# Altium project Acoustic Guitar Tuner.PrjPcb
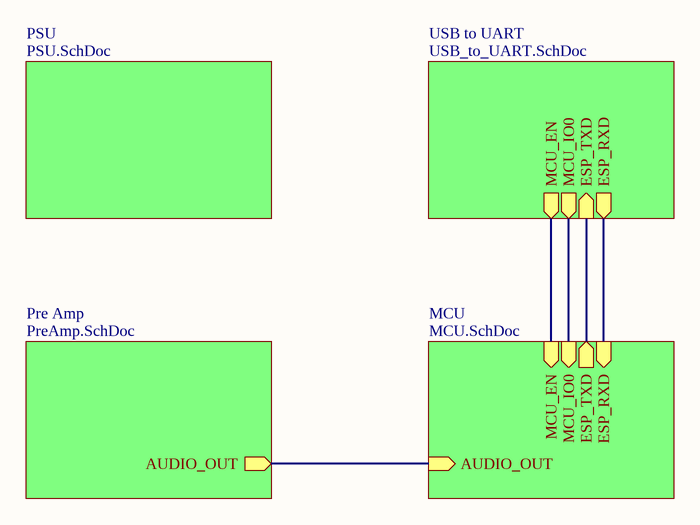
[diagram p0: MainSheet.SchDoc]
5 sheets, 67 parts. Net scope: hierarchical (ports join the sheet entries above them; power ports are global).
Board file: PCB1.PcbDoc
Sheets:
  MainSheet.SchDoc
    Pre Amp = PreAmp.SchDoc
    MCU = MCU.SchDoc
    PSU = PSU.SchDoc
    USB to UART = USB_to_UART.SchDoc

## Sheet MainSheet.SchDoc
size A; SheetNumber: 1; SheetTotal: 5

### Sub-sheets
MCU = MCU.SchDoc: ESP_TXD (out), ESP_RXD (in), MCU_EN (in), MCU_IO0 (in), AUDIO_OUT (in)
Pre Amp = PreAmp.SchDoc: AUDIO_OUT (out)
PSU = PSU.SchDoc: no entries
USB to UART = USB_to_UART.SchDoc: ESP_TXD (in), ESP_RXD (out), MCU_IO0 (out), MCU_EN (out)

### Nets
AUDIO_OUT: sheet Pre Amp/AUDIO_OUT, sheet MCU/AUDIO_OUT
NetC7_2: sheet MCU/MCU_EN, sheet USB to UART/MCU_EN
NetIC2_25: sheet MCU/MCU_IO0, sheet USB to UART/MCU_IO0
NetIC2_34: sheet MCU/ESP_RXD, sheet USB to UART/ESP_RXD
NetIC2_35: sheet MCU/ESP_TXD, sheet USB to UART/ESP_TXD

## Sheet PreAmp.SchDoc
size A; SheetNumber: 2; SheetTotal: 5
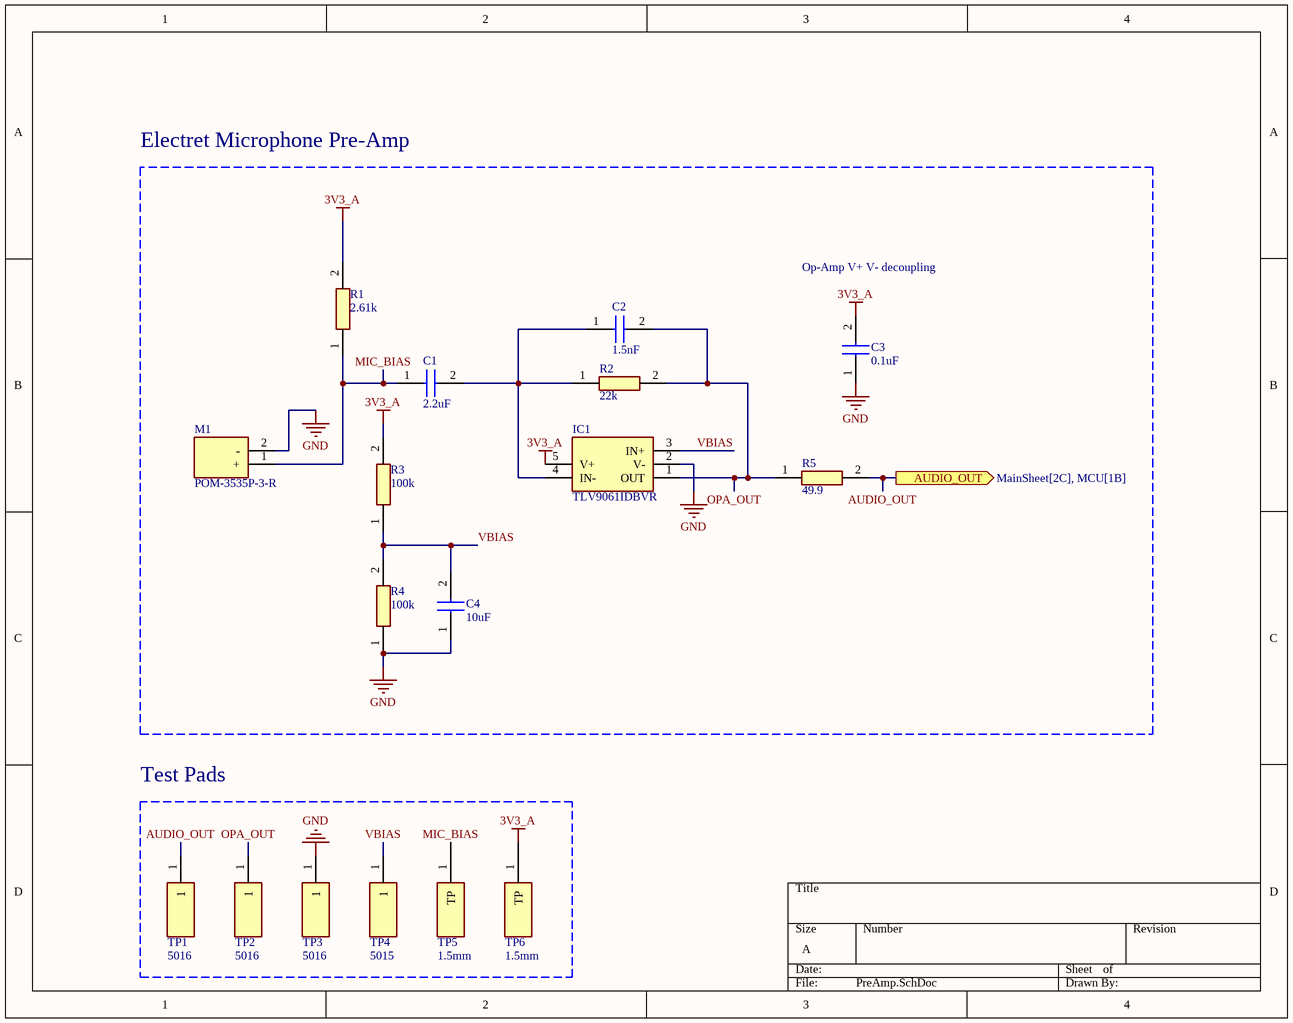
[diagram p1: PreAmp.SchDoc]

### Parts
C1  2.2uF  [C0805]
C2  1.5nF  [C0805]
C3  0.1uF  [CAPC2012X88N]
C4  10uF  [CAPC2012X140N]
IC1  TLV9061IDBVR  [SOT95P280X145-5N]
M1  POM-3535P-3-R  [POM3535P3R]
R1  2.61k  [RESC2012X60N]
R2  22k  [RESC2012X50N]
R3  100k  [RESC2012X60N]
R4  100k  [RESC2012X60N]
R5  49.9  [RESC2012X50N]
TP1  5016  [5016]
TP2  5016  [5016]
TP3  5016  [5016]
TP4  5015  [5015]
TP5  1.5mm  [TESTPAD_1P5MM]
TP6  1.5mm  [TESTPAD_1P5MM]

### Blocks framed on the sheet
Electret Microphone Pre-Amp: C1-C4 IC1 M1 R1-R5
Test Pads: TP1-TP6

### Ports
AUDIO_OUT (out, see MainSheet[2C], MCU[1B])

### Nets
3V3_A: C3.2 IC1.5(V+) R1.2 R3.2 TP6.1(TP)
GND: C3.1 C4.1 IC1.2(V-) M1.2(-) R4.1 TP3.1
AUDIO_OUT: R5.2 TP1.1 ; port AUDIO_OUT
MIC_BIAS: C1.1 M1.1(+) R1.1 TP5.1(TP)
OPA_OUT: C2.2 IC1.1(OUT) R2.2 R5.1 TP2.1
VBIAS: C4.2 IC1.3(IN+) R3.1 R4.2 TP4.1
NetC1_2: C1.2 C2.1 IC1.4(IN-) R2.1

### Notes on the sheet
- Op-Amp V+ V- decoupling

### Library data of the parts
C1 = 2.2uF Capacitor 0805: Capacitor; Manufacturer_Name: Yageo Group; Manufacturer_Part_Number: C0805C225K8PACTU; Datasheet Link: https://www.yageogroup.com/content/datasheet/asset/file/KEM_C1006_X5R_SMD; Height: 1.1mm; Mouser Part Number: 80-C0805C225K8P; Mouser Price/Stock: https://www.mouser.co.uk/ProductDetail/KEMET/C0805C225K8PACTU?qs=hIohqi1S7IpPfscGpw9Z0g%3D%3D; Arrow Part Number: C0805C225K8PACTU; Arrow Price/Stock: https://www.arrow.com/en/products/c0805c225k8pactu/kemet-corporation?region=nac
C2 = 1.5nF Capaciator 0805: Capacitor; Manufacturer_Name: Yageo Group; Manufacturer_Part_Number: C0805C152J5GACTU; Datasheet Link: https://www.yageogroup.com/content/datasheet/asset/file/KEM_C1003_C0G_SMD; Height: 1.1mm
C3 = 0.1uF Capacitor 0805: Capacitor; Manufacturer_Name: Yageo Group; Manufacturer_Part_Number: C0805C104K5RAC-TU; Datasheet Link: https://componentsearchengine.com/Datasheets/2/C0805C104K5RAC-TU.pdf; Height: 0.88mm; Arrow Part Number: C0805C104K5RAC-TU; Arrow Price/Stock: https://www.arrow.com/en/products/c0805c104k5ractu/kemet-corporation
C4 = 10uF Capacitor 0805: Capacitor; Manufacturer_Name: Yageo Group; Manufacturer_Part_Number: C0805C106K8PACTU-2.5; Datasheet Link: https://www.kemet.com/specsheet/C0805C106K8PACTU; Height: 1.4mm; Mouser Part Number: N/A; Mouser Price/Stock: https://www.mouser.com/Search/Refine.aspx?Keyword=N%2FA
IC1 = TLV9061IDBVR: Integrated Circuit; Manufacturer_Name: Texas Instruments; Datasheet Link: http://www.ti.com/lit/gpn/tlv9061; Height: 1.45mm; Manufacturer_Part_Number: TLV9061IDBVR; Mouser Part Number: 595-TLV9061IDBVR; Mouser Price/Stock: https://www.mouser.co.uk/ProductDetail/Texas-Instruments/TLV9061IDBVR?qs=w%2Fv1CP2dgqpra2GA6pq5aQ%3D%3D; Arrow Part Number: TLV9061IDBVR; Arrow Price/Stock: https://www.arrow.com/en/products/tlv9061idbvr/texas-instruments?utm_currency=USD&region=nac
M1 = Electret Microphone: Microphone; Manufacturer_Name: PUI Audio; Datasheet Link: https://componentsearchengine.com/Datasheets/1/POM-3535P-3-R.pdf; Height: 4mm; Manufacturer_Part_Number: POM-3535P-3-R; Mouser Part Number: 665-POM-3535P-3-R; Mouser Price/Stock: https://www.mouser.co.uk/ProductDetail/PUI-Audio/POM-3535P-3-R?qs=SFtkwOqhffnBMPjb%2F%2FZCSg%3D%3D
R1 = 2.61k Resistor 0805: Resistor; Manufacturer_Name: Yageo Group; Manufacturer_Part_Number: RC0805FR-072K61L; Datasheet Link: http://www.yageo.com/documents/recent/PYu-RC_Group_51_RoHS_L_10.pdf; Height: 0.6mm; Mouser Part Number: 603-RC0805FR-072K61L; Mouser Price/Stock: https://www.mouser.co.uk/ProductDetail/Yageo/RC0805FR-072K61L?qs=QrWOOBGzeCaZVRFf6Fg7Ew%3D%3D; Arrow Part Number: RC0805FR-072K61L; Arrow Price/Stock: https://www.arrow.com/en/products/rc0805fr-072k61l/yageo?region=nac
R2 = 22k Resistor 0805: Resistor; Manufacturer_Name: Vishay; Manufacturer_Part_Number: CRCW080522K0FKEA; Datasheet Link: http://www.vishay.com/docs/20035/dcrcwe3.pdf; Height: 0.5mm; Mouser Part Number: 71-CRCW0805-22K-E3; Mouser Price/Stock: https://www.mouser.co.uk/ProductDetail/Vishay-Dale/CRCW080522K0FKEA?qs=fIsz7OpyEY835T0D7WGkRw%3D%3D; Arrow Part Number: CRCW080522K0FKEA; Arrow Price/Stock: https://www.arrow.com/en/products/crcw080522k0fkea/vishay?region=europe
R3 R4 = 100k Resistor: Resistor; Manufacturer_Name: Vishay; Manufacturer_Part_Number: CRCW0805100KFKEAHP; Datasheet Link: https://componentsearchengine.com/Datasheets/1/CRCW08051R00FKEAHP.pdf; Height: 0.6mm; Mouser Part Number: 71-CRCW0805100KFKEAH; Mouser Price/Stock: https://www.mouser.co.uk/ProductDetail/Vishay-Dale/CRCW0805100KFKEAHP?qs=k2%2FDWSARqgFvzezk%252B9pwaw%3D%3D; Arrow Part Number: CRCW0805100KFKEAHP; Arrow Price/Stock: https://www.arrow.com/en/products/crcw0805100kfkeahp/vishay.html?utm_currency=USD&region=europe
R5 = 49.9 Resistor: Resistor; Manufacturer_Name: Vishay; Manufacturer_Part_Number: CRCW080549R9FKEA; Datasheet Link: http://www.vishay.com/docs/20035/dcrcwe3.pdf; Height: 0.5mm; Mouser Part Number: 71-CRCW0805-49.9-E3; Mouser Price/Stock: https://www.mouser.co.uk/ProductDetail/Vishay-Dale/CRCW080549R9FKEA?qs=kkyyugUlSrO9cI3mexpXiA%3D%3D; Arrow Part Number: CRCW080549R9FKEA; Arrow Price/Stock: https://www.arrow.com/en/products/crcw080549r9fkea/vishay
TP1-TP3 = 5016: Test Pad; Manufacturer_Name: Keystone Electronics; Datasheet Link: http://www.keyelco.com/product-pdf.cfm?p=1354; Manufacturer_Part_Number: 5016; Mouser Part Number: 534-5016; Mouser Price/Stock: https://www.mouser.co.uk/ProductDetail/Keystone-Electronics/5016?qs=qOqV1E1P08QbNAXL8l0G1A%3D%3D; Arrow Part Number: 5016; Arrow Price/Stock: https://www.arrow.com/en/products/5016/keystone-electronics?utm_currency=USD&region=europe
TP4 = 5015: Test Pad; Manufacturer_Name: Keystone Electronics; Datasheet Link: http://www.keyelco.com/product-pdf.cfm?p=1353; Height: 1.52mm; Manufacturer_Part_Number: 5015; Mouser Part Number: 534-5015; Mouser Price/Stock: https://www.mouser.co.uk/ProductDetail/Keystone-Electronics/5015?qs=qOqV1E1P08ShW56PtUq2FA%3D%3D; Arrow Part Number: 5015; Arrow Price/Stock: https://www.arrow.com/en/products/5015/keystone-electronics?utm_currency=USD&region=europe
TP5 TP6 = TEST_POINT_1PIN: 1.5mm Bare Test Pad

## Sheet MCU.SchDoc
size A; SheetNumber: 3; SheetTotal: 5
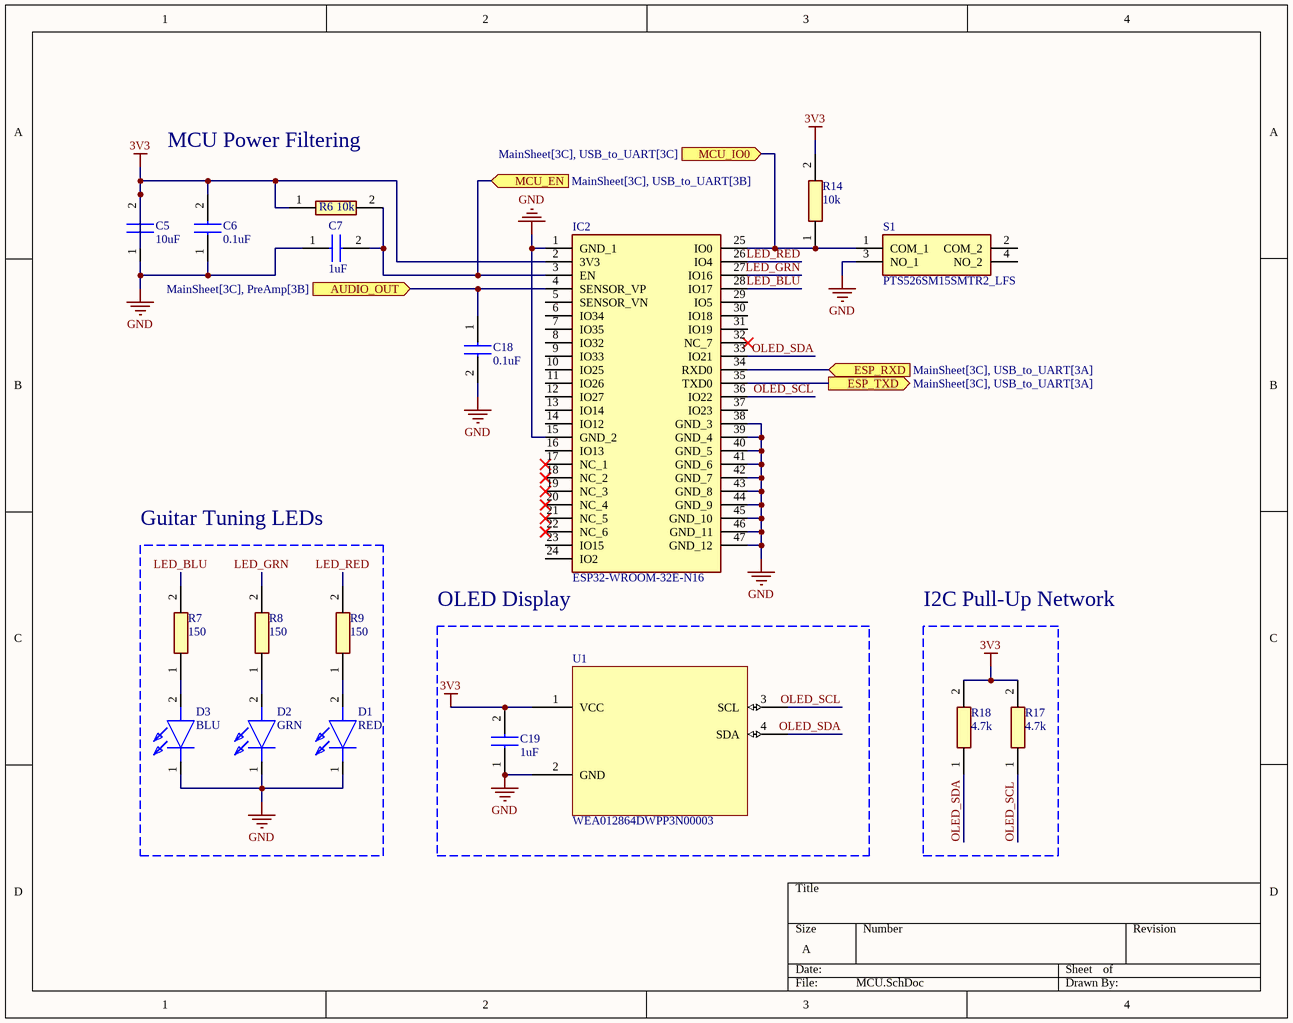
[diagram p2: MCU.SchDoc]

### Parts
C5  10uF  [CAPC2012X140N]
C6  0.1uF  [CAPC2012X88N]
C7  1uF  [CAPC2012X145N]
C18  0.1uF  [CAPC2012X88N]
C19  1uF  [GRM21BR60J226ME39L]
D1  RED  [LEDC2012X85N]
D2  GRN  [LEDC2012X85N]
D3  BLU  [LEDC2012X85N]
IC2  ESP32-WROOM-32E-N16  [ESP32WROOM32EN16]
R6  10k  [ERA6AEB101V]
R7  150  [RESC2012X50N]
R8  150  [RESC2012X50N]
R9  150  [RESC2012X50N]
R14  10k  [ERA6AEB101V]
R17  4.7k  [RESC2012X60N]
R18  4.7k  [RESC2012X60N]
S1  PTS526SM15SMTR2_LFS  [PTS526SM15SMTR2LFS]
U1  WEA012864DWPP3N00003  [OLED_128x64_I2C]

### Blocks framed on the sheet
Guitar Tuning LEDs: D1-D3 R7-R9
OLED Display: C19 U1
I2C Pull-Up Network: R17 R18

### Ports
AUDIO_OUT (in, see MainSheet[3C], PreAmp[3B]), ESP_RXD (in, see MainSheet[3C], USB_to_UART[3A]), ESP_TXD (out, see MainSheet[3C], USB_to_UART[3A]), MCU_EN (in, see MainSheet[3C], USB_to_UART[3B]), MCU_IO0 (in, see MainSheet[3C], USB_to_UART[3C])

### Nets
3V3: C5.2 C6.2 C19.2 IC2.2(3V3) R6.1 R14.2 R17.2 R18.2 U1.1(VCC)
GND: C5.1 C6.1 C7.1 C18.2 C19.1 D1.1(K) D2.1(K) D3.1(K) IC2.1(GND_1) IC2.15(GND_2) IC2.38(GND_3) IC2.39(GND_4) IC2.40(GND_5) IC2.41(GND_6) IC2.42(GND_7) IC2.43(GND_8) IC2.44(GND_9) IC2.45(GND_10) IC2.46(GND_11) IC2.47(GND_12) S1.3(NO_1) U1.2(GND)
AUDIO_OUT: C18.1 IC2.4(SENSOR_VP) ; port AUDIO_OUT
LED_BLU: IC2.28(IO17) R7.2
LED_GRN: IC2.27(IO16) R8.2
LED_RED: IC2.26(IO4) R9.2
OLED_SCL: IC2.36(IO22) R17.1 U1.3(SCL)
OLED_SDA: IC2.33(IO21) R18.1 U1.4(SDA)
NetC7_2: C7.2 IC2.3(EN) R6.2 ; port MCU_EN
NetD1_2: D1.2(A) R9.1
NetD2_2: D2.2(A) R8.1
NetD3_2: D3.2(A) R7.1
NetIC2_25: IC2.25(IO0) R14.1 S1.1(COM_1) ; port MCU_IO0
NetIC2_34: IC2.34(RXD0) ; port ESP_RXD
NetIC2_35: IC2.35(TXD0) ; port ESP_TXD

Not connected (* = marked no-connect by the designer): IC2 5(SENSOR_VN) 6(IO34) 7(IO35) 8(IO32) 9(IO33) 10(IO25) 11(IO26) 12(IO27) 13(IO14) 14(IO12) 16(IO13) 17(NC_1)* 18(NC_2)* 19(NC_3)* 20(NC_4)* 21(NC_5)* 22(NC_6)* 23(IO15) 24(IO2) 29(IO5) 30(IO18) 31(IO19) 32(NC_7)* 37(IO23); S1 2(COM_2) 4(NO_2)

### Notes on the sheet
- MCU Power Filtering

### Library data of the parts
C5 = 10uF Capacitor 0805: as C4 on sheet PreAmp; Datasheet Link: https://www.kemet.com/specsheet/C0805C106K8PACTU; Height: 1.4mm; Mouser Part Number: N/A; Mouser Price/Stock: https://www.mouser.com/Search/Refine.aspx?Keyword=N%2FA
C6 C18 = 0.1uF Capacitor 0805: as C3 on sheet PreAmp; Datasheet Link: https://componentsearchengine.com/Datasheets/2/C0805C104K5RAC-TU.pdf; Height: 0.88mm; Arrow Part Number: C0805C104K5RAC-TU; Arrow Price/Stock: https://www.arrow.com/en/products/c0805c104k5ractu/kemet-corporation
C7 = 1uF Capacitor 0805: Capacitor; Manufacturer_Name: Murata Electronics; Manufacturer_Part_Number: GRM21BR71A105KA01L; Datasheet Link: https://search.murata.co.jp/Ceramy/image/img/A01X/G101/ENG/GRM21BR71A105KA01-01A.pdf; Height: 1.45mm; Mouser Part Number: 81-GRM40X105K10L; Mouser Price/Stock: https://www.mouser.co.uk/ProductDetail/Murata-Electronics/GRM21BR71A105KA01L?qs=Rc6BINVvJ%2FjIxBp0DnLtzA%3D%3D; Arrow Part Number: GRM21BR71A105KA01L; Arrow Price/Stock: https://www.arrow.com/en/products/grm21br71a105ka01l/murata-manufacturing
C19 = 1uF Capacitor: Capacitor; Manufacturer_Name: Murata Electronics; Manufacturer_Part_Number: GRM21BR61A105KA01L; Datasheet Link: https://search.murata.co.jp/Ceramy/image/img/A01X/G101/ENG/GRM21BR61A105KA01-01A.pdf; Height: 1.45mm; Mouser Part Number: 81-GRM21R61A105KA01L; Mouser Price/Stock: https://www.mouser.co.uk/ProductDetail/Murata-Electronics/GRM21BR61A105KA01L?qs=E0xLyVzY5mZAKW6GqdeKBA%3D%3D; Arrow Part Number: GRM21BR61A105KA01L; Arrow Price/Stock: https://www.arrow.com/en/products/grm21br61a105ka01l/murata-manufacturing
D1 = Red LED: LED; Manufacturer_Name: Kingbright; Manufacturer_Part_Number: APT2012EC; Datasheet Link: http://www.us.kingbright.com/images/catalog/SPEC/APT2012EC.pdf; Height: 0.85mm; Mouser Part Number: 604-APT2012EC; Mouser Price/Stock: https://www.mouser.co.uk/ProductDetail/Kingbright/APT2012EC?qs=sXafwHSx%252BU%252BiK4iO%2FHnV4A%3D%3D; Arrow Part Number: APT2012EC; Arrow Price/Stock: https://www.arrow.com/en/products/apt2012ec/kingbright?region=nac
D2 = Green LED: LED; Manufacturer_Name: Kingbright; Manufacturer_Part_Number: APT2012SGC; Datasheet Link: http://www.us.kingbright.com/images/catalog/SPEC/APT2012SGC.pdf; Height: 0.85mm; Mouser Part Number: 604-APT2012SGC; Mouser Price/Stock: https://www.mouser.co.uk/ProductDetail/Kingbright/APT2012SGC?qs=SxaZfIVsCL28XycY%2FuxqiQ%3D%3D; Arrow Part Number: APT2012SGC; Arrow Price/Stock: https://www.arrow.com/en/products/apt2012sgc/kingbright?region=nac
D3 = Blue LED: LED; Manufacturer_Name: Kingbright; Manufacturer_Part_Number: APT2012LVBC/D; Datasheet Link: https://componentsearchengine.com/Datasheets/1/APT2012LVBC_D.pdf; Height: 0.85mm; Mouser Part Number: 604-APT2012LVBCD; Mouser Price/Stock: https://www.mouser.co.uk/ProductDetail/Kingbright/APT2012LVBC-D?qs=6oMev5NRZMGErJYT6KZLXg%3D%3D; Arrow Part Number: APT2012LVBC/D; Arrow Price/Stock: https://www.arrow.com/en/products/apt2012lvbcd/kingbright?utm_currency=USD&region=nac
IC2 = ESP32-WROOM-32E-N16: Integrated Circuit; Manufacturer_Name: Espressif Systems; Datasheet Link: https://www.espressif.com/sites/default/files/documentation/esp32-wroom-32e_esp32-wroom-32ue_datasheet_en.pdf; Height: 3.25mm; Manufacturer_Part_Number: ESP32-WROOM-32E-N16; Mouser Part Number: 356-ESP32WRM32E128PH; Mouser Price/Stock: https://www.mouser.co.uk/ProductDetail/Espressif-Systems/ESP32-WROOM-32E-N16?qs=Li%252BoUPsLEnsC4cA%252BUYB2Bw%3D%3D
R6 R14 = 10k Resistor 0805: Resistor; Manufacturer_Name: Panasonic; Manufacturer_Part_Number: ERA-6AED103V; Datasheet Link: https://industrial.panasonic.com/cdbs/www-data/pdf/RDM0000/AOA0000C307.pdf; Height: 0.6mm; Mouser Part Number: 667-ERA-6AED103V; Mouser Price/Stock: https://www.mouser.co.uk/ProductDetail/Panasonic/ERA-6AED103V?qs=MNPzkKEzRtSGdYymydDO9g%3D%3D; Arrow Part Number: ERA-6AED103V; Arrow Price/Stock: https://www.arrow.com/en/products/era-6aed103v/panasonic?region=nac
R7-R9 = 150 Resistor 0805: Resistor; Manufacturer_Name: Vishay; Manufacturer_Part_Number: CRCW0805150RFKEA; Datasheet Link: http://www.vishay.com/docs/20035/dcrcwe3.pdf; Height: 0.5mm; Mouser Part Number: 71-CRCW0805-150-E3; Mouser Price/Stock: https://www.mouser.co.uk/ProductDetail/Vishay-Dale/CRCW0805150RFKEA?qs=bMjB6bAaLEMlCPoDkVBLpg%3D%3D; Arrow Part Number: CRCW0805150RFKEA; Arrow Price/Stock: https://www.arrow.com/en/products/crcw0805150rfkea/vishay?region=nac
R17 R18 = 4.7k Resistor 0805: Resistor; Manufacturer_Name: Yageo Group; Manufacturer_Part_Number: RC0805FR-074K7L; Datasheet Link: http://www.yageo.com/documents/recent/PYu-RC_Group_51_RoHS_L_10.pdf; Height: 0.6mm; Mouser Part Number: 603-RC0805FR-074K7L; Mouser Price/Stock: https://www.mouser.co.uk/ProductDetail/YAGEO/RC0805FR-074K7L?qs=VLOqbHBAO5cYXbrd7RTmuQ%3D%3D; Arrow Part Number: RC0805FR-074K7L; Arrow Price/Stock: https://www.arrow.com/en/products/rc0805fr-074k7l/yageo?utm_currency=USD&region=nac
S1 = PTS526SM15SMTR2_LFS: Switch; Manufacturer_Name: LITTELFUSE; Manufacturer_Part_Number: PTS526SM15SMTR2 LFS; Datasheet Link: https://www.ckswitches.com/media/2780/pts526.pdf; Height: 1.65mm; Mouser Part Number: 611-PTS526SM15SMTR2L; Mouser Price/Stock: https://www.mouser.co.uk/ProductDetail/CK/PTS526SM15SMTR2-LFS?qs=Imq1NPwxi75LpUh6FiCy2w%3D%3D
U1 = WEA012864DWPP3N00003: OLED_128x64_I2C

## Sheet PSU.SchDoc
size A; SheetNumber: 5; SheetTotal: 5
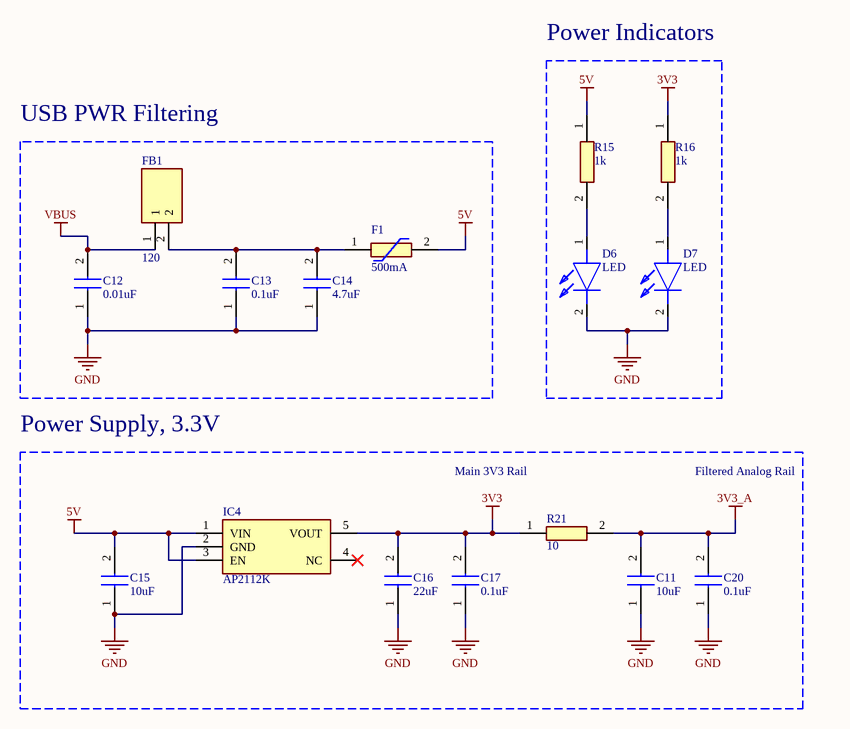
[diagram p3: PSU.SchDoc]

### Parts
C11  10uF  [CAPC2012X140N]
C12  0.01uF  [C0805]
C13  0.1uF  [CAPC2012X88N]
C14  4.7uF  [C0805]
C15  10uF  [CAPC2012X140N]
C16  22uF  [C0805]
C17  0.1uF  [CAPC2012X88N]
C20  0.1uF  [CAPC2012X88N]
D6  LED  [APT2012SECKJ3PRV]
D7  LED  [APT2012SECKJ3PRV]
F1  500mA  [1206L05015YR]
FB1  120  [BLM21AG102BH1J]
IC4  AP2112K  [SOT95P285X140-5N]
R15  1k  [RESC2012X60N]
R16  1k  [RESC2012X60N]
R21  10  [RESC2012X50N]

### Blocks framed on the sheet
Power Indicators: D6 D7 R15 R16
USB PWR Filtering: C12-C14 F1 FB1
Power Supply, 3.3V: C11 C15-C17 C20 IC4 R21

### Nets
3V3: C16.2 C17.2 IC4.5(VOUT) R16.1 R21.1
3V3_A: C11.2 C20.2 R21.2
5V: C15.2 F1.2 IC4.1(VIN) IC4.3(EN) R15.1
GND: C11.1 C12.1 C13.1 C14.1 C15.1 C16.1 C17.1 C20.1 D6.2(K) D7.2(K) IC4.2(GND)
VBUS: C12.2 FB1.1
NetC13_2: C13.2 C14.2 F1.1 FB1.2
NetD6_1: D6.1(A) R15.2
NetD7_1: D7.1(A) R16.2

Not connected (* = marked no-connect by the designer): IC4 4(NC)*

### Notes on the sheet
- Main 3V3 Rail
- Filtered Analog Rail

### Library data of the parts
C11 C15 = 10uF Capacitor 0805: as C4 on sheet PreAmp; Datasheet Link: https://www.kemet.com/specsheet/C0805C106K8PACTU; Height: 1.4mm; Mouser Part Number: N/A; Mouser Price/Stock: https://www.mouser.com/Search/Refine.aspx?Keyword=N%2FA
C12 = 0.01uF Capacitor 0805: Capacitor; Manufacturer_Name: Yageo Group; Manufacturer_Part_Number: C0805C103K1RECTU; Datasheet Link: https://www.yageogroup.com/content/datasheet/asset/file/KEM_C1090_X7R_ESD; Height: 1.1mm
C13 C17 C20 = 0.1uF Capacitor 0805: as C3 on sheet PreAmp; Datasheet Link: https://componentsearchengine.com/Datasheets/2/C0805C104K5RAC-TU.pdf; Height: 0.88mm; Arrow Part Number: C0805C104K5RAC-TU; Arrow Price/Stock: https://www.arrow.com/en/products/c0805c104k5ractu/kemet-corporation
C14 = 4.7uF Capacitor 0805: Capacitor; Manufacturer_Name: Yageo Group; Manufacturer_Part_Number: C0805X475M8RACTU; Datasheet Link: https://www.yageogroup.com/content/datasheet/asset/file/KEM_C1013_X7R_FT-CAP_SMD; Height: 1.1mm; Mouser Part Number: 80-C0805X475M8R; Mouser Price/Stock: https://www.mouser.com/Search/Refine.aspx?Keyword=80-C0805X475M8R; Arrow Part Number: C0805X475M8RACTU; Arrow Price/Stock: https://www.arrow.com/en/products/c0805x475m8ractu/kemet-corporation
C16 = 22uF Capacitor 0805: Capacitor; Manufacturer_Name: Yageo Group; Manufacturer_Part_Number: C0805C226M8PAC7210; Datasheet Link: https://www.yageogroup.com/content/datasheet/asset/file/KEM_C1006_X5R_SMD; Height: 1.1mm; Mouser Part Number: 80-C0805C226M8P7210; Mouser Price/Stock: https://www.mouser.co.uk/ProductDetail/KEMET/C0805C226M8PAC7210?qs=cGEy3R83DS8oofmRMj%2F42w%3D%3D
D6 D7 = Orange LED: Manufacturer_Name: Kingbright; Manufacturer_Part_Number: APT2012SECK/J3-PRV; Datasheet Link: https://www.mouser.ph/ProductDetail/Kingbright/APT2012SECK-J3-PRV?qs=D2TOvUWgdJ6T9J6WfI%252BQOg%3D%3D; Height: 0.85mm; Mouser Part Number: 604-APT2012SECKJ3PRV; Mouser Price/Stock: https://www.mouser.co.uk/ProductDetail/Kingbright/APT2012SECK-J3-PRV?qs=D2TOvUWgdJ6T9J6WfI%252BQOg%3D%3D; Arrow Part Number: APT2012SECK/J3-PRV; Arrow Price/Stock: https://www.arrow.com/en/products/apt2012seckj3-prv/kingbright?region=nac
F1 = 500mA Fuse: Resettable Fuse; Manufacturer_Name: LITTELFUSE; Manufacturer_Part_Number: 1206L050YR; Datasheet Link: https://m.littelfuse.com/~/media/electronics/datasheets/resettable_ptcs/littelfuse_ptc_1206l_datasheet.pdf.pdf; Height: 0.75mm; Mouser Part Number: 576-1206L050YR; Mouser Price/Stock: https://www.mouser.co.uk/ProductDetail/Littelfuse/1206L050YR?qs=PWhpLWeW8wckT8hV5jLiAA%3D%3D; Arrow Part Number: 1206L050YR; Arrow Price/Stock: https://www.arrow.com/en/products/1206l050yr/littelfuse.html?utm_currency=USD&region=europe
FB1 = 120 Ferrite Bead: Filter; Manufacturer_Name: Murata Electronics; Manufacturer_Part_Number: BLM21PG121SN1D; Datasheet Link: https://www.murata.com/en-us/products/productdetail?partno=BLM21PG121SN1%23; Height: 1.05mm; Mouser Part Number: 81-BLM21PG121SN1D; Mouser Price/Stock: https://www.mouser.co.uk/ProductDetail/Murata-Electronics/BLM21PG121SN1D?qs=MY6wChARw2zaR3kESBLGTQ%3D%3D; Arrow Part Number: BLM21PG121SN1D; Arrow Price/Stock: https://www.arrow.com/en/products/blm21pg121sn1d/murata-manufacturing?utm_currency=USD&region=europe
IC4 = LDO: Integrated Circuit; Manufacturer_Name: Diodes Incorporated; Manufacturer_Part_Number: AP2112K-3.3TRG1; Datasheet Link: https://www.diodes.com//assets/Datasheets/AP2112.pdf; Height: 1.4mm; Mouser Part Number: 621-AP2112K-3.3TRG1; Mouser Price/Stock: https://www.mouser.co.uk/ProductDetail/Diodes-Incorporated/AP2112K-3.3TRG1?qs=x6A8l6qLYDDPYHosCdzh%2FA%3D%3D; Arrow Part Number: AP2112K-3.3TRG1; Arrow Price/Stock: https://www.arrow.com/en/products/ap2112k-3-3trg1_3/diodes-incorporated.html?utm_currency=USD&region=nac
R15 R16 = 1k Resistor: Resistor; Manufacturer_Name: Yageo Group; Manufacturer_Part_Number: RC0805FR-071KL; Datasheet Link: https://www.yageo.com/upload/media/product/productsearch/datasheet/rchip/PYu-RC_Group_51_RoHS_L_11.pdf; Height: 0.6mm; Mouser Part Number: 603-RC0805FR-071KL; Mouser Price/Stock: https://www.mouser.co.uk/ProductDetail/YAGEO/RC0805FR-071KL?qs=1ogmaHw32WJjeGY0DHXakQ%3D%3D; Arrow Part Number: RC0805FR-071KL; Arrow Price/Stock: https://www.arrow.com/en/products/rc0805fr-071kl/yageo?utm_currency=USD&region=europe
R21 = 10 Resistor 0805: Resistor; Manufacturer_Name: Vishay; Manufacturer_Part_Number: CRCW080510R0FKEA; Datasheet Link: http://www.vishay.com/docs/20035/dcrcwe3.pdf; Height: 0.5mm; Mouser Part Number: 71-CRCW0805-10-E3; Mouser Price/Stock: https://www.mouser.co.uk/ProductDetail/Vishay-Dale/CRCW080510R0FKEA?qs=LOX6nxTstiaUTSGGiXqphg%3D%3D; Arrow Part Number: CRCW080510R0FKEA; Arrow Price/Stock: https://www.arrow.com/en/products/crcw080510r0fkea/vishay

## Sheet USB_to_UART.SchDoc
size A; SheetNumber: 4; SheetTotal: 5
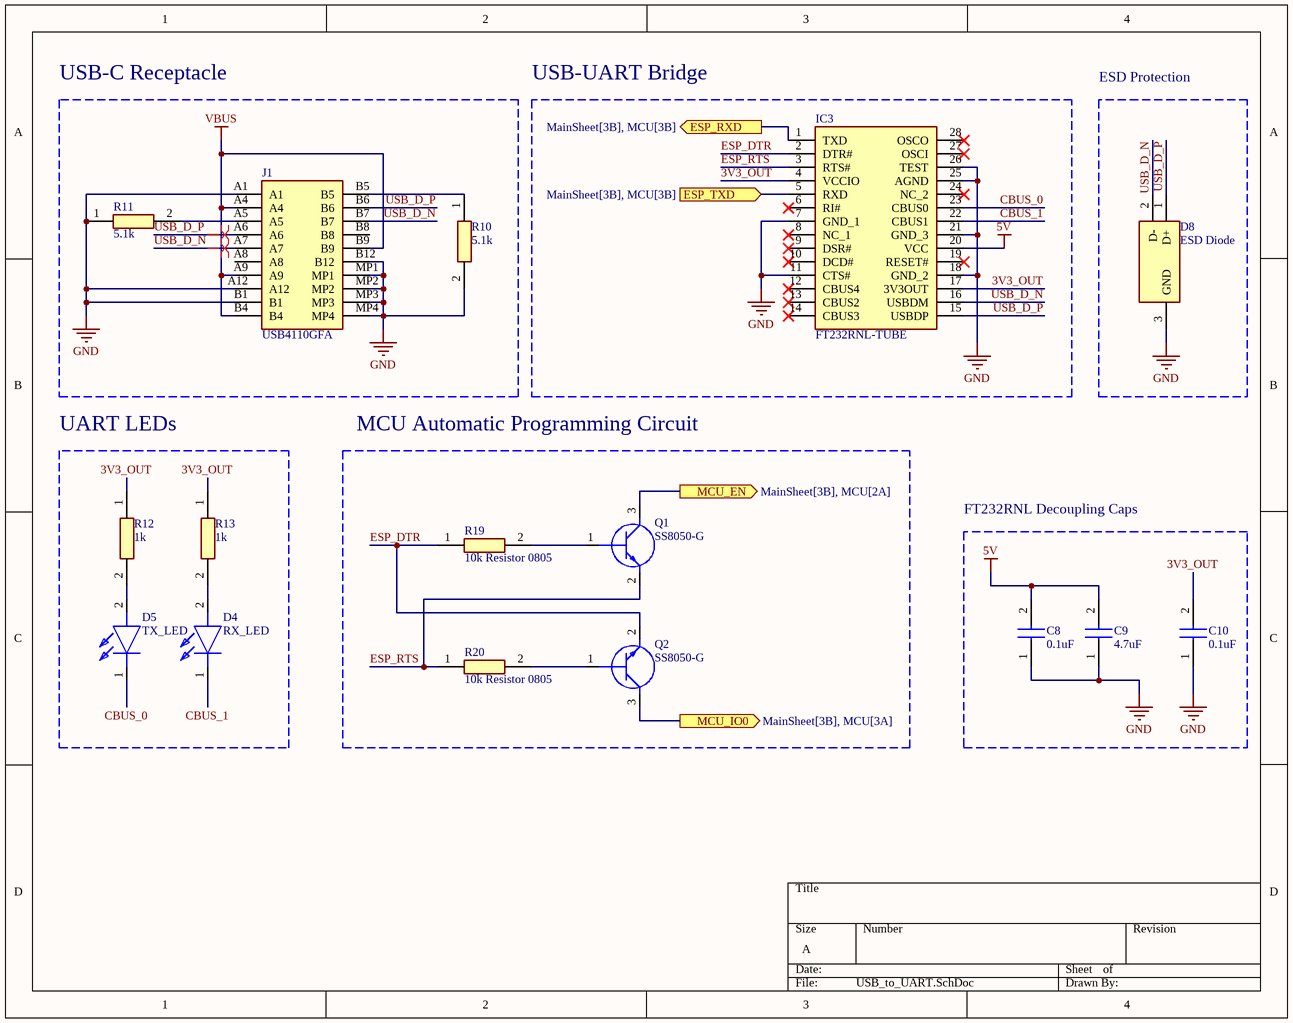
[diagram p4: USB_to_UART.SchDoc]

### Parts
C8  0.1uF  [CAPC2012X88N]
C9  4.7uF  [C0805]
C10  0.1uF  [CAPC2012X88N]
D4  RX_LED  [LEDC2012X85N]
D5  TX_LED  [LEDC2012X85N]
D8  ESD Diode  [SOTFL35P100X50-3N]
IC3  FT232RNL-TUBE  [SOP65P780X200-28N]
J1  USB4110GFA  [USB4110GFA]
Q1  SS8050-G  [SOT95P240X115-3N]
Q2  SS8050-G  [SOT95P240X115-3N]
R10  5.1k  [RESC2012X60N]
R11  5.1k  [RESC2012X60N]
R12  1k  [RESC2012X60N]
R13  1k  [RESC2012X60N]
R19  10k Resistor 0805  [ERA6AEB101V]
R20  10k Resistor 0805  [ERA6AEB101V]

### Blocks framed on the sheet
USB-C Receptacle: J1 R10 R11
USB-UART Bridge: IC3
ESD Protection: D8
UART LEDs: D4 D5 R12 R13
MCU Automatic Programming Circuit: Q1 Q2 R19 R20
FT232RNL Decoupling Caps: C8-C10

### Ports
ESP_RXD (out, see MainSheet[3B], MCU[3B]), ESP_TXD (in, see MainSheet[3B], MCU[3B]), MCU_EN (out, see MainSheet[3B], MCU[2A]), MCU_IO0 (out, see MainSheet[3B], MCU[3A])

### Nets
5V: C8.2 C9.2 IC3.20(VCC)
GND: C8.1 C9.1 C10.1 D8.3(GND) IC3.7(GND_1) IC3.11(CTS#) IC3.18(GND_2) IC3.21(GND_3) IC3.25(AGND) IC3.26(TEST) J1.A1 J1.A12 J1.B1 J1.B12 J1.MP1 J1.MP2 J1.MP3 J1.MP4 R10.2 R11.1
VBUS: J1.A4 J1.A9 J1.B4 J1.B9
3V3_OUT: C10.2 IC3.4(VCCIO) IC3.17(3V3OUT) R12.1 R13.1
CBUS_0: D5.1(K) IC3.23(CBUS0)
CBUS_1: D4.1(K) IC3.22(CBUS1)
ESP_DTR: IC3.2(DTR#) Q2.2(E) R19.1
ESP_RTS: IC3.3(RTS#) Q1.2(E) R20.1
USB_D_N: D8.2(D-) IC3.16(USBDM) J1.A7 J1.B7
USB_D_P: D8.1(D+) IC3.15(USBDP) J1.A6 J1.B6
NetC7_2: Q1.3(C) ; port MCU_EN
NetD4_2: D4.2(A) R13.2
NetD5_2: D5.2(A) R12.2
NetIC2_25: Q2.3(C) ; port MCU_IO0
NetIC2_34: IC3.1(TXD) ; port ESP_RXD
NetIC2_35: IC3.5(RXD) ; port ESP_TXD
NetJ1_A5: J1.A5 R11.2
NetJ1_B5: J1.B5 R10.1
NetQ1_1: Q1.1(B) R19.2
NetQ2_1: Q2.1(B) R20.2

Not connected (* = marked no-connect by the designer): IC3 6(RI#)* 8(NC_1)* 9(DSR#)* 10(DCD#)* 12(CBUS4)* 13(CBUS2)* 14(CBUS3)* 19(RESET#)* 24(NC_2)* 27(OSCI)* 28(OSCO)*; J1 A8 B8

### Layout directives
differential pair: USB_D_N, USB_D_P

### Library data of the parts
C8 C10 = 0.1uF Capacitor 0805: as C3 on sheet PreAmp; Datasheet Link: https://componentsearchengine.com/Datasheets/2/C0805C104K5RAC-TU.pdf; Height: 0.88mm; Arrow Part Number: C0805C104K5RAC-TU; Arrow Price/Stock: https://www.arrow.com/en/products/c0805c104k5ractu/kemet-corporation
C9 = 4.7uF Capacitor 0805: as C14 on sheet PSU; Datasheet Link: https://www.yageogroup.com/content/datasheet/asset/file/KEM_C1013_X7R_FT-CAP_SMD; Height: 1.1mm; Mouser Part Number: 80-C0805X475M8R; Mouser Price/Stock: https://www.mouser.com/Search/Refine.aspx?Keyword=80-C0805X475M8R; Arrow Part Number: C0805X475M8RACTU; Arrow Price/Stock: https://www.arrow.com/en/products/c0805x475m8ractu/kemet-corporation
D4 D5 = Green LED: as D2 on sheet MCU; Datasheet Link: http://www.us.kingbright.com/images/catalog/SPEC/APT2012SGC.pdf; Height: 0.85mm; Mouser Part Number: 604-APT2012SGC; Mouser Price/Stock: https://www.mouser.co.uk/ProductDetail/Kingbright/APT2012SGC?qs=SxaZfIVsCL28XycY%2FuxqiQ%3D%3D; Arrow Part Number: APT2012SGC; Arrow Price/Stock: https://www.arrow.com/en/products/apt2012sgc/kingbright?region=nac
D8 = ESD Diode: Diode; Manufacturer_Name: Texas Instruments; Manufacturer_Part_Number: TPD2EUSB30DRTR; Datasheet Link: https://datasheet.datasheetarchive.com/originals/distributors/SFDatasheet-11/sf-000234749.pdf; Height: 0.5mm; Mouser Part Number: 595-TPD2EUSB30DRTR; Mouser Price/Stock: https://www.mouser.co.uk/ProductDetail/Texas-Instruments/TPD2EUSB30DRTR?qs=%2Fqzd9s%252BcLd6bPJi5HXCDvw%3D%3D; Arrow Part Number: TPD2EUSB30DRTR; Arrow Price/Stock: https://www.arrow.com/en/products/tpd2eusb30drtr/texas-instruments?utm_currency=USD&region=nac
IC3 = FT232RNL-TUBE: Integrated Circuit; Manufacturer_Name: FTDI Chip; Datasheet Link: https://ftdichip.com/wp-content/uploads/2023/03/DS_FT232RN.pdf; Height: 2mm; Manufacturer_Part_Number: FT232RNL-TUBE; Mouser Part Number: 895-FT232RNL-TUBE; Mouser Price/Stock: https://www.mouser.co.uk/ProductDetail/FTDI/FT232RNL-TUBE?qs=By6Nw2ByBD3n6DWgWW3egA%3D%3D; Arrow Part Number: FT232RNL-TUBE; Arrow Price/Stock: https://www.arrow.com/en/products/ft232rnl-tube/ftdi-chip?utm_currency=USD&region=europe
J1 = USB-C Receptacle: Connector; Manufacturer_Name: GCT (GLOBAL CONNECTOR TECHNOLOGY); Manufacturer_Part_Number: USB4110-GF-A; Datasheet Link: https://gct.co/files/drawings/usb4110.pdf; Height: 3.26mm; Mouser Part Number: 640-USB4110-GF-A; Mouser Price/Stock: https://www.mouser.co.uk/ProductDetail/GCT/USB4110-GF-A?qs=KUoIvG%2F9IlYiZvIXQjyJeA%3D%3D
Q1 Q2 = SS8050-G: Transistor BJT NPN; Manufacturer_Name: Comchip Technology; Datasheet Link: https://datasheet.datasheetarchive.com/originals/distributors/DKDS-12/229454.pdf; Height: 1.15mm; Manufacturer_Part_Number: SS8050-G; Mouser Part Number: 750-SS8050-G; Mouser Price/Stock: https://www.mouser.co.uk/ProductDetail/Comchip-Technology/SS8050-G?qs=LLUE9lz1YbcHg%252BWLMAtcrQ%3D%3D; Arrow Part Number: SS8050-G; Arrow Price/Stock: https://www.arrow.com/en/products/ss8050-g/comchip-technology?region=nac
R10 R11 = 5.1k Resistor 0805: Resistor; Manufacturer_Name: Vishay; Manufacturer_Part_Number: CRCW08055K10JNEAHP; Datasheet Link: https://componentsearchengine.com/Datasheets/1/CRCW08051R00FKEAHP.pdf; Height: 0.6mm; Mouser Part Number: 71-CRCW08055K10JNEAH; Mouser Price/Stock: https://www.mouser.co.uk/ProductDetail/Vishay/CRCW08055K10JNEAHP?qs=hWgE7mdIu5RTpd75lMnc9Q%3D%3D
R12 R13 = 1k Resistor: as R15 on sheet PSU; Datasheet Link: https://www.yageo.com/upload/media/product/productsearch/datasheet/rchip/PYu-RC_Group_51_RoHS_L_11.pdf; Height: 0.6mm; Mouser Part Number: 603-RC0805FR-071KL; Mouser Price/Stock: https://www.mouser.co.uk/ProductDetail/YAGEO/RC0805FR-071KL?qs=1ogmaHw32WJjeGY0DHXakQ%3D%3D; Arrow Part Number: RC0805FR-071KL; Arrow Price/Stock: https://www.arrow.com/en/products/rc0805fr-071kl/yageo?utm_currency=USD&region=europe
R19 R20 = 10k Resistor 0805: as R6 on sheet MCU; Datasheet Link: https://industrial.panasonic.com/cdbs/www-data/pdf/RDM0000/AOA0000C307.pdf; Height: 0.6mm; Mouser Part Number: 667-ERA-6AED103V; Mouser Price/Stock: https://www.mouser.co.uk/ProductDetail/Panasonic/ERA-6AED103V?qs=MNPzkKEzRtSGdYymydDO9g%3D%3D; Arrow Part Number: ERA-6AED103V; Arrow Price/Stock: https://www.arrow.com/en/products/era-6aed103v/panasonic?region=nac

## Nets that join several sheets
3V3: MCU (9 pins), PSU (5 pins)
3V3_A: PreAmp (5 pins), PSU (C11.2 C20.2 R21.2)
5V: PSU (5 pins), USB_to_UART (C8.2 C9.2 IC3.20)
GND: PreAmp (6 pins), MCU (22 pins), PSU (11 pins), USB_to_UART (20 pins)
VBUS: PSU (C12.2 FB1.1), USB_to_UART (J1.A4 J1.A9 J1.B4 J1.B9)
AUDIO_OUT: PreAmp (R5.2 TP1.1), MCU (C18.1 IC2.4)
NetC7_2: MCU (C7.2 IC2.3 R6.2), USB_to_UART (Q1.3)
NetIC2_25: MCU (IC2.25 R14.1 S1.1), USB_to_UART (Q2.3)
NetIC2_34: MCU (IC2.34), USB_to_UART (IC3.1)
NetIC2_35: MCU (IC2.35), USB_to_UART (IC3.5)